# EAGLE design esp32_balance (EAGLE 7.7.0)
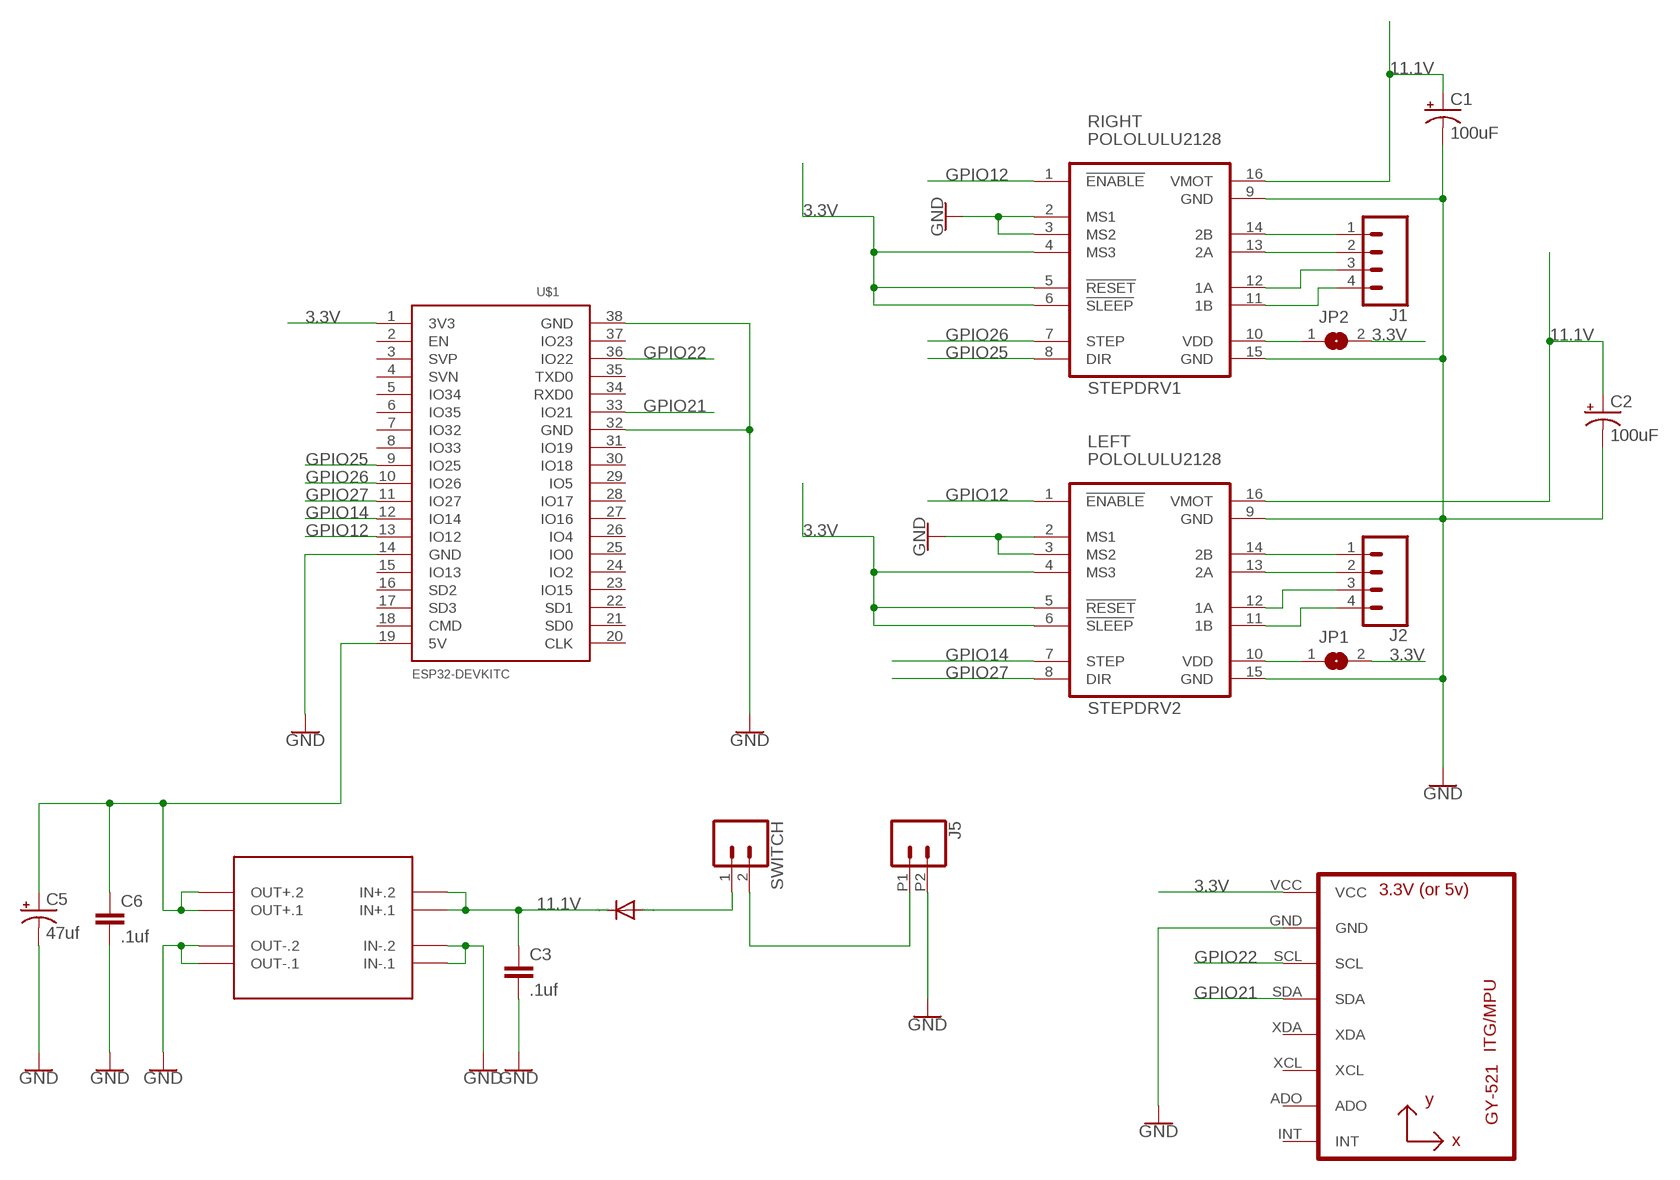
[diagram p0: schematic, sheet 1]

## Parts
C1  100uF  100UF-POLAR-RADIAL-2.5MM-25V-20%  [CPOL-RADIAL-2.5MM-6.5MM]
C2  100uF  100UF-POLAR-RADIAL-2.5MM-25V-20%  [CPOL-RADIAL-2.5MM-6.5MM]
C3  .1uf  22PF-PTH-2.54MM-200V-5%  [CAP-PTH-2.54]
C5  47uf  100UF-POLAR-RADIAL-2.5MM-25V-20%  [CPOL-RADIAL-2.5MM-6.5MM]
C6  .1uf  22PF-PTH-2.54MM-200V-5%  [CAP-PTH-2.54]
D1  1N4004  [DO41-10]
J1  CONN_04  [1X04]
J2  CONN_04  [1X04]
J5  CONN_022.54MM_SCREWTERM  [1X02_2.54_SCREWTERM]
JP1  SJW  [SJW]
JP2  SJW  [SJW]
STEPDRV1  POLOLULU2128  [POLOLULU2128]
STEPDRV2  POLOLULU2128  [POLOLULU2128]
SWITCH  CONN_02  [1X02]
U1  GY-521MPU6050  [GY-521]
U$1  ESP32DEVKITC  [ESP32-DEVKITC]
U$3  DC-DC-STEP-DOWN-MP1584  [DC-DC-STEP-DOWN-MP1584]

## Nets
3.3V: JP1.2 JP2.2 STEPDRV1.4(MS3) STEPDRV1.5(!RESET) STEPDRV1.6(!SLEEP) STEPDRV2.4(MS3) STEPDRV2.5(!RESET) STEPDRV2.6(!SLEEP) U1.VCC U$1.1(3V3)
11.1V: C1.1(+) C2.1(+) C3.1 D1.C STEPDRV1.16(VMOT) STEPDRV2.16(VMOT) U$3.IN+.1 U$3.IN+.2
GND: C1.2(-) C2.2(-) C3.2 C5.2(-) C6.2 J5.P2 STEPDRV1.2(MS1) STEPDRV1.3(MS2) STEPDRV1.9(GND) STEPDRV1.15(GND) STEPDRV2.2(MS1) STEPDRV2.3(MS2) STEPDRV2.9(GND) STEPDRV2.15(GND) U1.GND U$1.14(GND) U$1.32(GND) U$1.38(GND) U$3.IN-.1 U$3.IN-.2 U$3.OUT-.1 U$3.OUT-.2
GPIO12: STEPDRV1.1(!ENABLE) STEPDRV2.1(!ENABLE) U$1.13(IO12)
GPIO14: STEPDRV2.7(STEP) U$1.12(IO14)
GPIO21: U1.SDA U$1.33(IO21)
GPIO22: U1.SCL U$1.36(IO22)
GPIO25: STEPDRV1.8(DIR) U$1.9(IO25)
GPIO26: STEPDRV1.7(STEP) U$1.10(IO26)
GPIO27: STEPDRV2.8(DIR) U$1.11(IO27)
N$1: J2.4 STEPDRV2.11(1B)
N$2: J2.3 STEPDRV2.12(1A)
N$3: J2.2 STEPDRV2.13(2A)
N$4: J2.1 STEPDRV2.14(2B)
N$5: J1.1 STEPDRV1.14(2B)
N$6: J1.2 STEPDRV1.13(2A)
N$7: J1.4 STEPDRV1.11(1B)
N$8: J1.3 STEPDRV1.12(1A)
N$9: D1.A SWITCH.1
N$10: C5.1(+) C6.1 U$1.19(5V) U$3.OUT+.1 U$3.OUT+.2
N$11: J5.P1 SWITCH.2
N$13: JP2.1 STEPDRV1.10(VDD)
N$14: JP1.1 STEPDRV2.10(VDD)
Unconnected: U1.ADO U1.INT U1.XCL U1.XDA U$1.2(EN) U$1.3(SVP) U$1.4(SVN) U$1.5(IO34) U$1.6(IO35) U$1.7(IO32) U$1.8(IO33) U$1.15(IO13) U$1.16(SD2) U$1.17(SD3) U$1.18(CMD) U$1.20(CLK) U$1.21(SD0) U$1.22(SD1) U$1.23(IO15) U$1.24(IO2) U$1.25(IO0) U$1.26(IO4) U$1.27(IO16) U$1.28(IO17) U$1.29(IO5) U$1.30(IO18) U$1.31(IO19) U$1.34(RXD0) U$1.35(TXD0) U$1.37(IO23)

## Notes on the sheet
- RIGHT
- LEFT

## Library data of the parts
C1 C2 = SparkFun-Capacitors:100UF-POLAR: 100µF polarized capacitors A capacitor is a passive two-terminal electrical component used to store electrical energy temporarily in an electric field.; PROD_ID: CAP-08439
C3 C6 = SparkFun-Capacitors:22PF: 22pF ceramic capacitors A capacitor is a passive two-terminal electrical component used to store electrical energy temporarily in an electric field.; PROD_ID: CAP-09128; VALUE: 22pF
C5 = SparkFun-Capacitors:100UF-POLAR: 100µF polarized capacitors A capacitor is a passive two-terminal electrical component used to store electrical energy temporarily in an electric field.; PROD_ID: CAP-08439; VALUE: 100uF
D1 = diode:1N4004: DIODE general purpose rectifier, 1 A
J1 J2 = SparkFun-Connectors:CONN_04: Multi connection point. Often used as Generic Header-pin footprint for 0.1 inch spaced/style header connections On any of the 0.1 inch spaced packages, you can populate with these: Break Away Headers - Straight <https://www.sparkfun.com/products/116> (PRT-00116) Break Away Male Headers - Right Angle <https://www.sparkfun.com/products/553> (PRT-00553) Female Headers <https://www.sparkfun.com/products/115> (PRT-00115) Break Away Headers - Machine Pin <https://www.sparkfun.com/products/117> (PRT-00117) Break Away Female Headers - Swiss Machine Pin <https://www.sparkfun.com/products/743> (PRT-00743) For SCREWTERMINALS and SPRING TERMINALS visit here: Screw Terimnals on SparkFun.com <https://www.sparkfun.com/search/results?term=Screw+Terminals> (5mm/3.5mm/2.54mm spacing) This device is also useful as a general connection point to wire up your design to another part of your project. Our various solder wires solder well into these plated through hole pads. Hook-Up Wire - Assortment (Stranded, 22 AWG) <https://www.sparkfun.com/products/11375> (PRT-11375) Hook-Up Wire - Assortment (Solid Core, 22 AWG) <https://www.sparkfun.com/products/11367> (PRT-11367) View the entire wire category on our website here <https://www.sparkfun.com/categories/141> Special notes: Molex polarized connector foot print use with SKU : PRT-08231 with associated crimp pins and housings. 1MM SMD Version SKU: PRT-10208; PROD_ID: CONN-09696
J5 SWITCH = SparkFun-Connectors:CONN_02: Multi connection point. Often used as Generic Header-pin footprint for 0.1 inch spaced/style header connections On any of the 0.1 inch spaced packages, you can populate with these: Break Away Headers - Straight <https://www.sparkfun.com/products/116> (PRT-00116) Break Away Male Headers - Right Angle <https://www.sparkfun.com/products/553> (PRT-00553) Female Headers <https://www.sparkfun.com/products/115> (PRT-00115) Break Away Headers - Machine Pin <https://www.sparkfun.com/products/117> (PRT-00117) Break Away Female Headers - Swiss Machine Pin <https://www.sparkfun.com/products/743> (PRT-00743) For SCREWTERMINALS and SPRING TERMINALS visit here: Screw Terimnals on SparkFun.com <https://www.sparkfun.com/search/results?term=Screw+Terminals> (5mm/3.5mm/2.54mm spacing) This device is also useful as a general connection point to wire up your design to another part of your project. Our various solder wires solder well into these plated through hole pads. Hook-Up Wire - Assortment (Stranded, 22 AWG) <https://www.sparkfun.com/products/11375> (PRT-11375) Hook-Up Wire - Assortment (Solid Core, 22 AWG) <https://www.sparkfun.com/products/11367> (PRT-11367) View the entire wire category on our website here <https://www.sparkfun.com/categories/141> Special notes: Molex polarized connector foot print use with: PRT-08233 with associated crimp pins and housings. 2.54_SCREWTERM for use with PRT-10571. 3.5mm Screw Terminal footprints for PRT-08084 5mm Screw Terminal footprints for use with PRT-08432
JP1 JP2 = jumper:SJ: SMD solder JUMPER
STEPDRV1 STEPDRV2 = stepper_drivers_etc:POLOLULU2128
U1 = gy-521:GY-521
U$1 = ESP32-DEVKITC:ESP32DEVKITC
U$3 = diy-modules:DC-DC-STEP-DOWN-MP1584: DC/DC Step-Down Regulator based on MP1584 chip MP1584 datasheet available here: http://www.haoyuelectronics.com/Attachment/MP1584/MP1584.pdf Click here to find device on ebay.com <http://www.ebay.com/sch/mp1584+module>

## Board
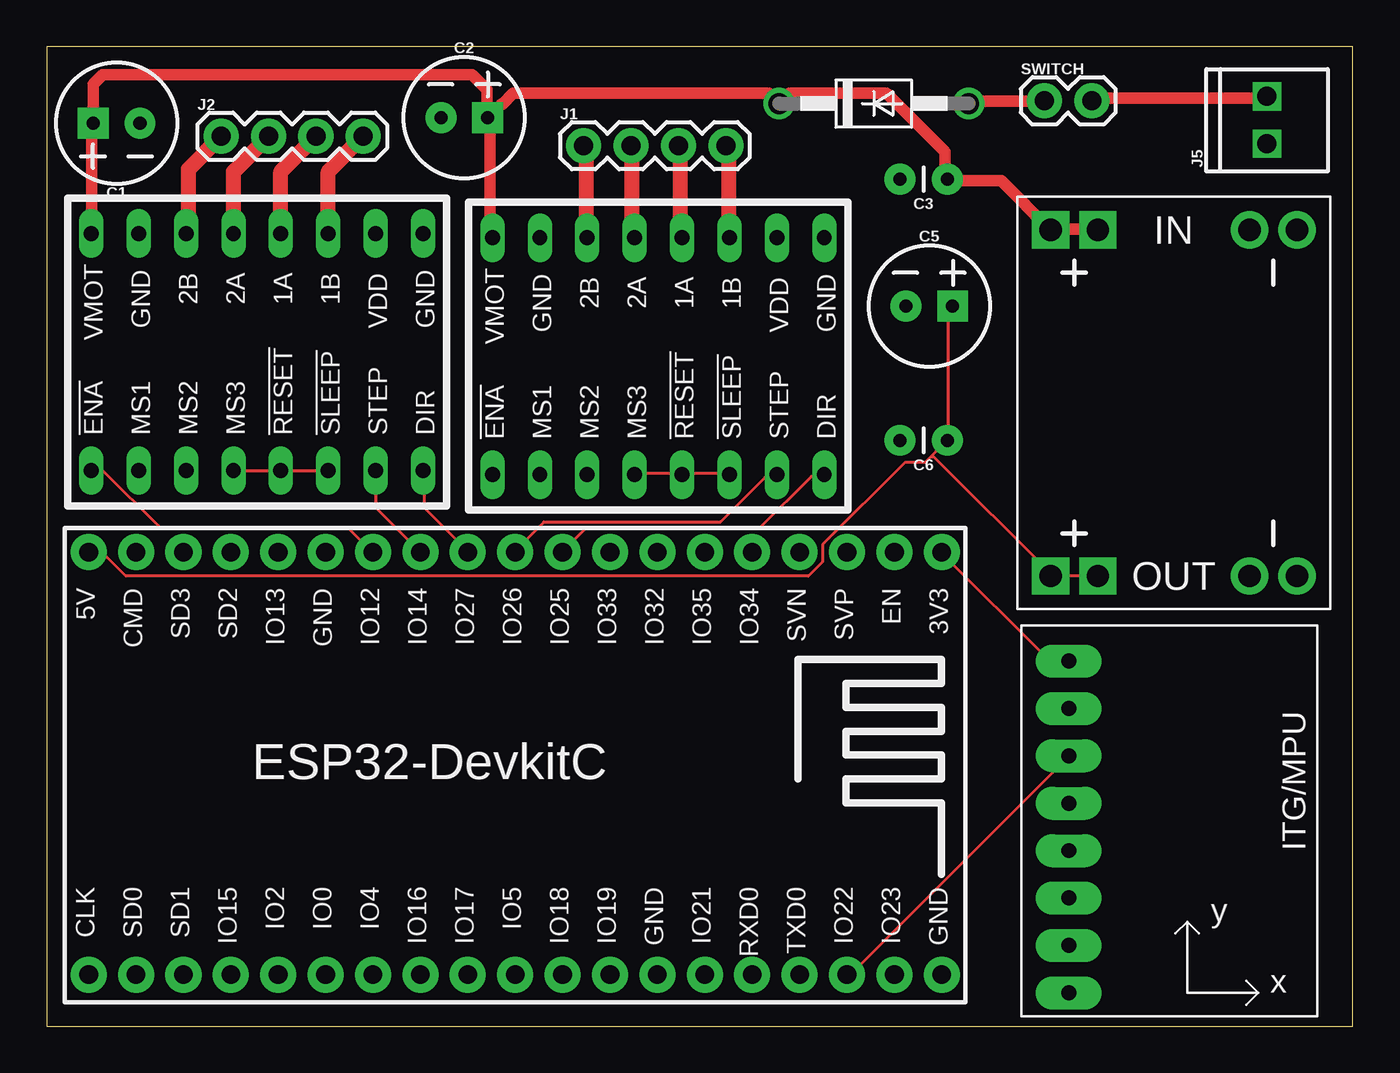
[diagram p1: board, top side]
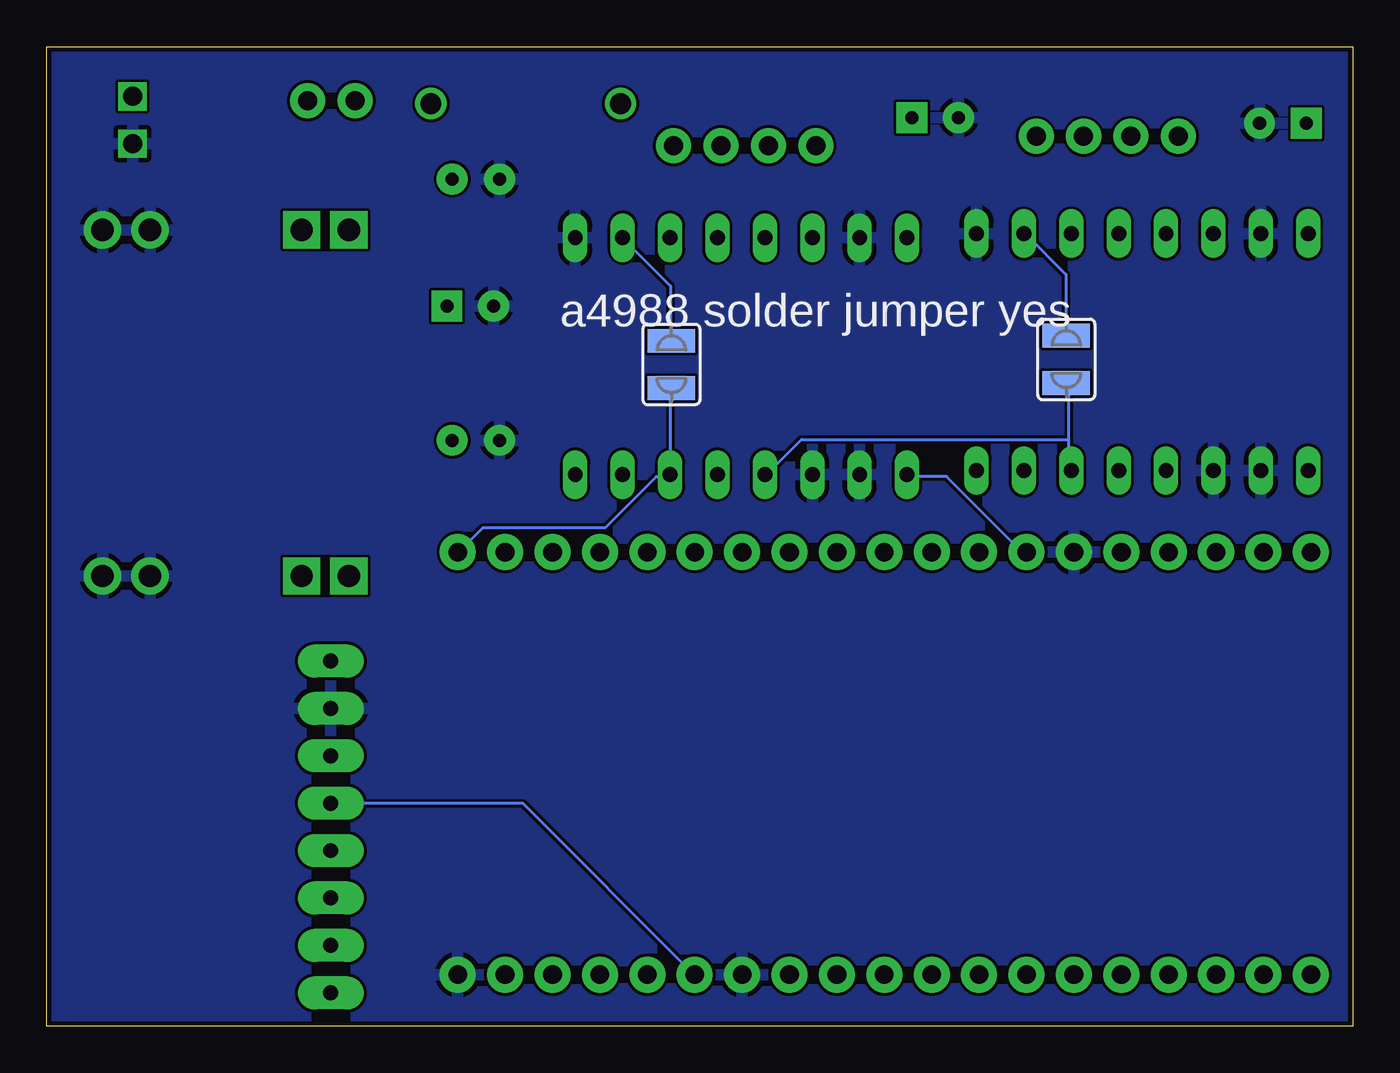
[diagram p2: board, bottom side, seen from below]

Size 70 x 52.5 mm. Coordinates in mm from the lower left corner, seen from the top.
Outline: 0,0 70,0 70,52.5 0,52.5 0,0
Copper layers (1*16): Top 0.035mm / dielectric 1.5mm / Bottom 0.035mm
Design rules "SeeedStudio_2layer_DRU_no_angle_20140221": minimum track width 6mil, minimum drill 12mil, track to track 6mil, track to pad 6mil, pad to pad 6mil, via to via 6mil, smd to smd 0mil, copper to edge 10mil, drill to drill 10mil, minimum pad ring 10mil, minimum via ring 6mil, stop-mask expansion 2mil, vias tented up to drill 100mil, thermal gap 10mil

### Footprints (pad centres in the part's own frame; a part is rotated, then mirrored left to right if it is on the bottom)
CPOL-RADIAL-2.5MM-6.5MM = drill 0.7 pad 1.651 square: 1 1.25,0 | drill 0.7 pad 1.651: 2 -1.25,0
CAP-PTH-2.54 = drill 0.7 pad 1.651: 1 -1.27,0; 2 1.27,0
DO41-10 = drill 1.118: A 5.08,0; C -5.08,0
1X04 = drill 1.016 pad 1.88: 1 0,0; 2 2.54,0; 3 5.08,0; 4 7.62,0
1X02_2.54_SCREWTERM = drill 1.016 square: P1 2.54,0; P2 0,0
SJW = smd 1.27 x 2.54: 1 -1.27,0; 2 1.27,0
POLOLULU2128 = drill 0.8 long: 1 -7.62,7.62; 2 -7.62,5.08; 3 -7.62,2.54; 4 -7.62,0; 5 -7.62,-2.54; 6 -7.62,-5.08; 7 -7.62,-7.62; 8 -7.62,-10.16; 9 5.08,-10.16; 10 5.08,-7.62; 11 5.08,-5.08; 12 5.08,-2.54; 13 5.08,0; 14 5.08,2.54; 15 5.08,5.08; 16 5.08,7.62
1X02 = drill 1.016 pad 1.88: 1 0,0; 2 2.54,0
GY-521 = drill 0.8 pad 1.778 long: ADO -8.89,-6.35; GND -8.89,6.35; INT -8.89,-8.89; SCL -8.89,3.81; SDA -8.89,1.27; VCC -8.89,8.89; XCL -8.89,-3.81; XDA -8.89,-1.27
ESP32-DEVKITC = drill 1 pad 1.93: 1 -22.87,-11.42; 2 -20.33,-11.42; 3 -17.79,-11.42; 4 -15.25,-11.42; 5 -12.71,-11.42; 6 -10.17,-11.42; 7 -7.63,-11.42; 8 -5.09,-11.42; 9 -2.55,-11.42; 10 -0.01,-11.42; 11 2.53,-11.42; 12 5.07,-11.42; 13 7.61,-11.42; 14 10.15,-11.42; 15 12.69,-11.42; 16 15.23,-11.42; 17 17.77,-11.42; 18 20.31,-11.42; 19 22.85,-11.42; 20 22.85,11.23; 21 20.31,11.23; 22 17.77,11.23; 23 15.23,11.23; 24 12.69,11.23; 25 10.15,11.23; 26 7.61,11.23; 27 5.07,11.23; 28 2.53,11.23; 29 -0.01,11.23; 30 -2.55,11.23; 31 -5.09,11.23; 32 -7.63,11.23; 33 -10.17,11.23; 34 -12.71,11.23; 35 -15.25,11.23; 36 -17.79,11.23; 37 -20.33,11.23; 38 -22.87,11.23
DC-DC-STEP-DOWN-MP1584 = drill 1.2 pad 2 square: IN+.1 -9.271,-4.064; IN+.2 -9.271,-6.604; OUT+.1 9.271,-4.064; OUT+.2 9.271,-6.604 | drill 1.2 pad 2: IN-.1 -9.271,6.604; IN-.2 -9.271,4.064; OUT-.1 9.271,6.604; OUT-.2 9.271,4.064

### Placement (x,y rotation side)
C1  3.75,48.4 180 top
C2  22.38,48.7 0 top
C3  47,45.4 180 top
C5  47.3,38.6 0 top
C6  47,31.4 180 top
D1  44.33,49.45 0 top
J1  28.78,47.19 0 top
J2  9.35,47.69 0 top
J5  65.4,47.3 90 top
JP1  15.36,35.74 270 bottom
JP2  36.52,35.47 270 bottom
STEPDRV1  31.51,37.18 90 top
STEPDRV2  10.01,37.4 90 top
SWITCH  53.47,49.6 0 top
U1  63.66,10.68 0 top
U$1  25.1,13.99 180 top
U$3  60.4,33.4 270 top

### Tracks (layer width: path | path; a pad name or v marks a point on that pad's centre or on a via)
3.3V
  Top 0.152: STEPDRV2.4 10.04,29.77 12.48,29.77 STEPDRV2.5 12.63,29.77 15.07,29.77 STEPDRV2.6 | STEPDRV1.4 31.53,29.61 33.97,29.61 STEPDRV1.5 34.12,29.61 36.56,29.61 STEPDRV1.6 | U1.VCC 54.69,19.71 53.63,19.71 47.99,25.35 U$1.1
  Bottom 0.152: 15.22,31.44 15.22,29.92 STEPDRV2.6 | 15.22,31.44 15.22,34.34 JP1.2 | JP2.2 36.56,34.19 36.56,29.61 STEPDRV1.6 36.71,29.46 37.32,29.46 40.06,26.72 46.62,26.72 47.84,25.5 U$1.1 | 15.22,31.44 29.55,31.44 31.38,29.61 STEPDRV1.4
11.1V
  Top 0.152: 48.29,45.31 C3.1 48.14,45.46 | 53.78,42.72 U$3.IN+.2 53.93,42.72 | 39.3,49.43 D1.C 39.15,49.43 | 56.22,42.72 U$3.IN+.1 | 2.42,42.57 STEPDRV2.16 | 2.42,48.36 C1.1 | 23.76,42.26 STEPDRV1.16 | 23.76,48.66 C2.1 23.76,48.82 24.36,49.43
  Top 0.61: 2.42,42.57 2.42,48.32 C1.1 2.5,50.5 3,51 22.8,51 23.6,50.2 23.6,48.73 C2.1 23.76,48.57 23.76,42.26 | 24.36,49.43 24.43,49.43 25,50 38.7,50 D1.C 39.8,50 45,50 48.14,46.86 48.14,45.46 | 48.29,45.31 51.16,45.31 U$3.IN+.2 | 53.93,42.72 56.29,42.72 U$3.IN+.1
GND
  pour Bottom: -2,54 -2,-2 72,-2 72,55 -2,55
GPIO12
  Top 0.152: STEPDRV2.1 2.42,29.77 3.03,29.77 6.08,26.72 16.14,26.72 17.36,25.5 U$1.13
  Bottom 0.152: STEPDRV1.1 23.76,29.46 21.77,29.46 17.81,25.5 17.51,25.5 U$1.13
GPIO14
  Top 0.152: STEPDRV2.7 17.66,29.77 17.66,27.79 19.95,25.5 U$1.12
GPIO21
  Bottom 0.152: U1.SDA 54.69,11.94 44.48,11.94 35.34,2.79 U$1.33
GPIO22
  Top 0.152: U1.SCL 54.69,14.37 42.96,2.64 U$1.36
GPIO25
  Top 0.152: STEPDRV1.8 41.59,29.46 40.98,29.46 38.23,26.72 28.94,26.72 27.72,25.5 U$1.9
GPIO26
  Top 0.152: STEPDRV1.7 39,29.46 38.54,29.46 36.1,27.02 26.65,27.02 25.13,25.5 U$1.10
GPIO27
  Top 0.152: STEPDRV2.8 20.25,29.77 20.25,27.79 22.54,25.5 U$1.11
N$1
  Top 0.813: STEPDRV2.11 15.09,45.81 J2.4
N$2
  Top 0.813: STEPDRV2.12 12.55,45.81 J2.3
N$3
  Top 0.813: STEPDRV2.13 10.01,45.81 J2.2
N$4
  Top 0.152: 7.6,42.57 STEPDRV2.14 | 9.28,47.6 J2.1
  Top 0.813: 7.6,42.57 7.6,45.94 J2.1
N$5
  Top 0.152: 28.94,46.99 28.79,47.14 J1.1 | 28.94,42.26 STEPDRV1.14
  Top 0.813: 28.94,42.26 28.94,47.03 J1.1
N$6
  Top 0.152: 31.38,42.26 STEPDRV1.13 | 31.38,47.14 J1.2
  Top 0.813: 31.38,42.26 31.38,47.13 J1.2
N$7
  Top 0.152: 36.56,46.99 36.41,47.14 J1.4 | 36.56,42.26 STEPDRV1.11
  Top 0.813: 36.56,42.26 36.56,47.03 J1.4
N$8
  Top 0.152: 33.97,42.26 STEPDRV1.12 | 33.97,47.14 J1.3
  Top 0.813: 33.97,42.26 33.97,47.08 J1.3
N$9
  Top 0.152: 49.51,49.58 D1.A | 53.32,49.58 SWITCH.1
  Top 0.61: 49.51,49.58 53.45,49.58 SWITCH.1
N$10
  Top 0.152: U$3.OUT+.1 56.22,24.13 53.93,24.13 U$3.OUT+.2 53.78,24.28 47.53,30.53 47.38,30.53 | C5.1 48.44,38.45 48.29,38.3 48.29,31.44 C6.1 48.14,31.29 47.38,30.53 | 47.38,30.53 47.07,30.22 46.01,30.22 41.59,25.8 41.59,24.89 40.82,24.13 4.25,24.13 3.03,25.35 2.27,25.35 U$1.19
N$11
  Top 0.152: 65.36,49.73 J5.P1 | 56.06,49.73 SWITCH.2
  Top 0.61: 56.06,49.73 65.29,49.73 J5.P1
N$13
  Bottom 0.152: JP2.1 36.56,36.78 36.56,39.67 39,42.11 STEPDRV1.10
N$14
  Bottom 0.152: JP1.1 15.37,37.08 15.37,40.28 17.51,42.41 STEPDRV2.10

### Text on the board
bNames: a4988 solder jumper yes